# Altium project Z693_H93_KD01_V1.3.PrjPCB
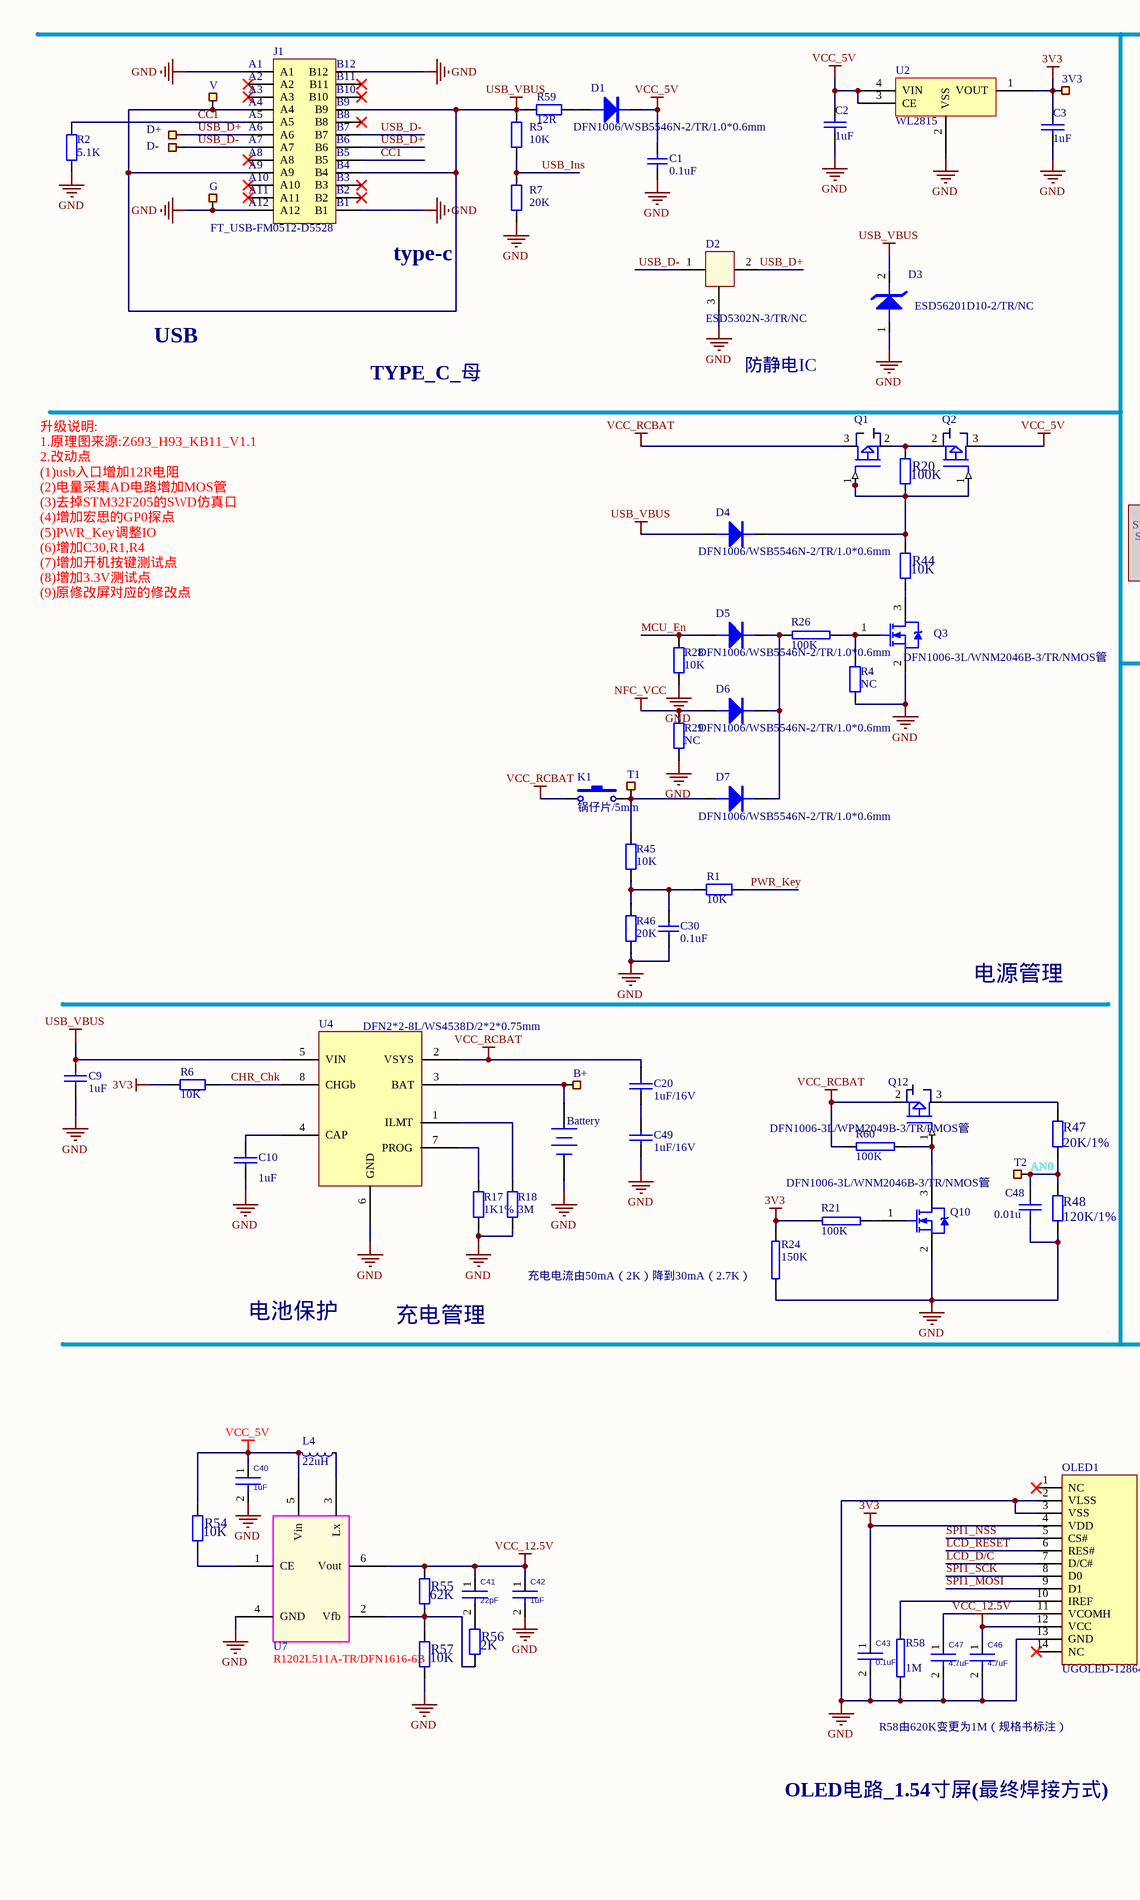
[diagram p0: Z693_H93_KD01_V1.3.SchDoc, left]
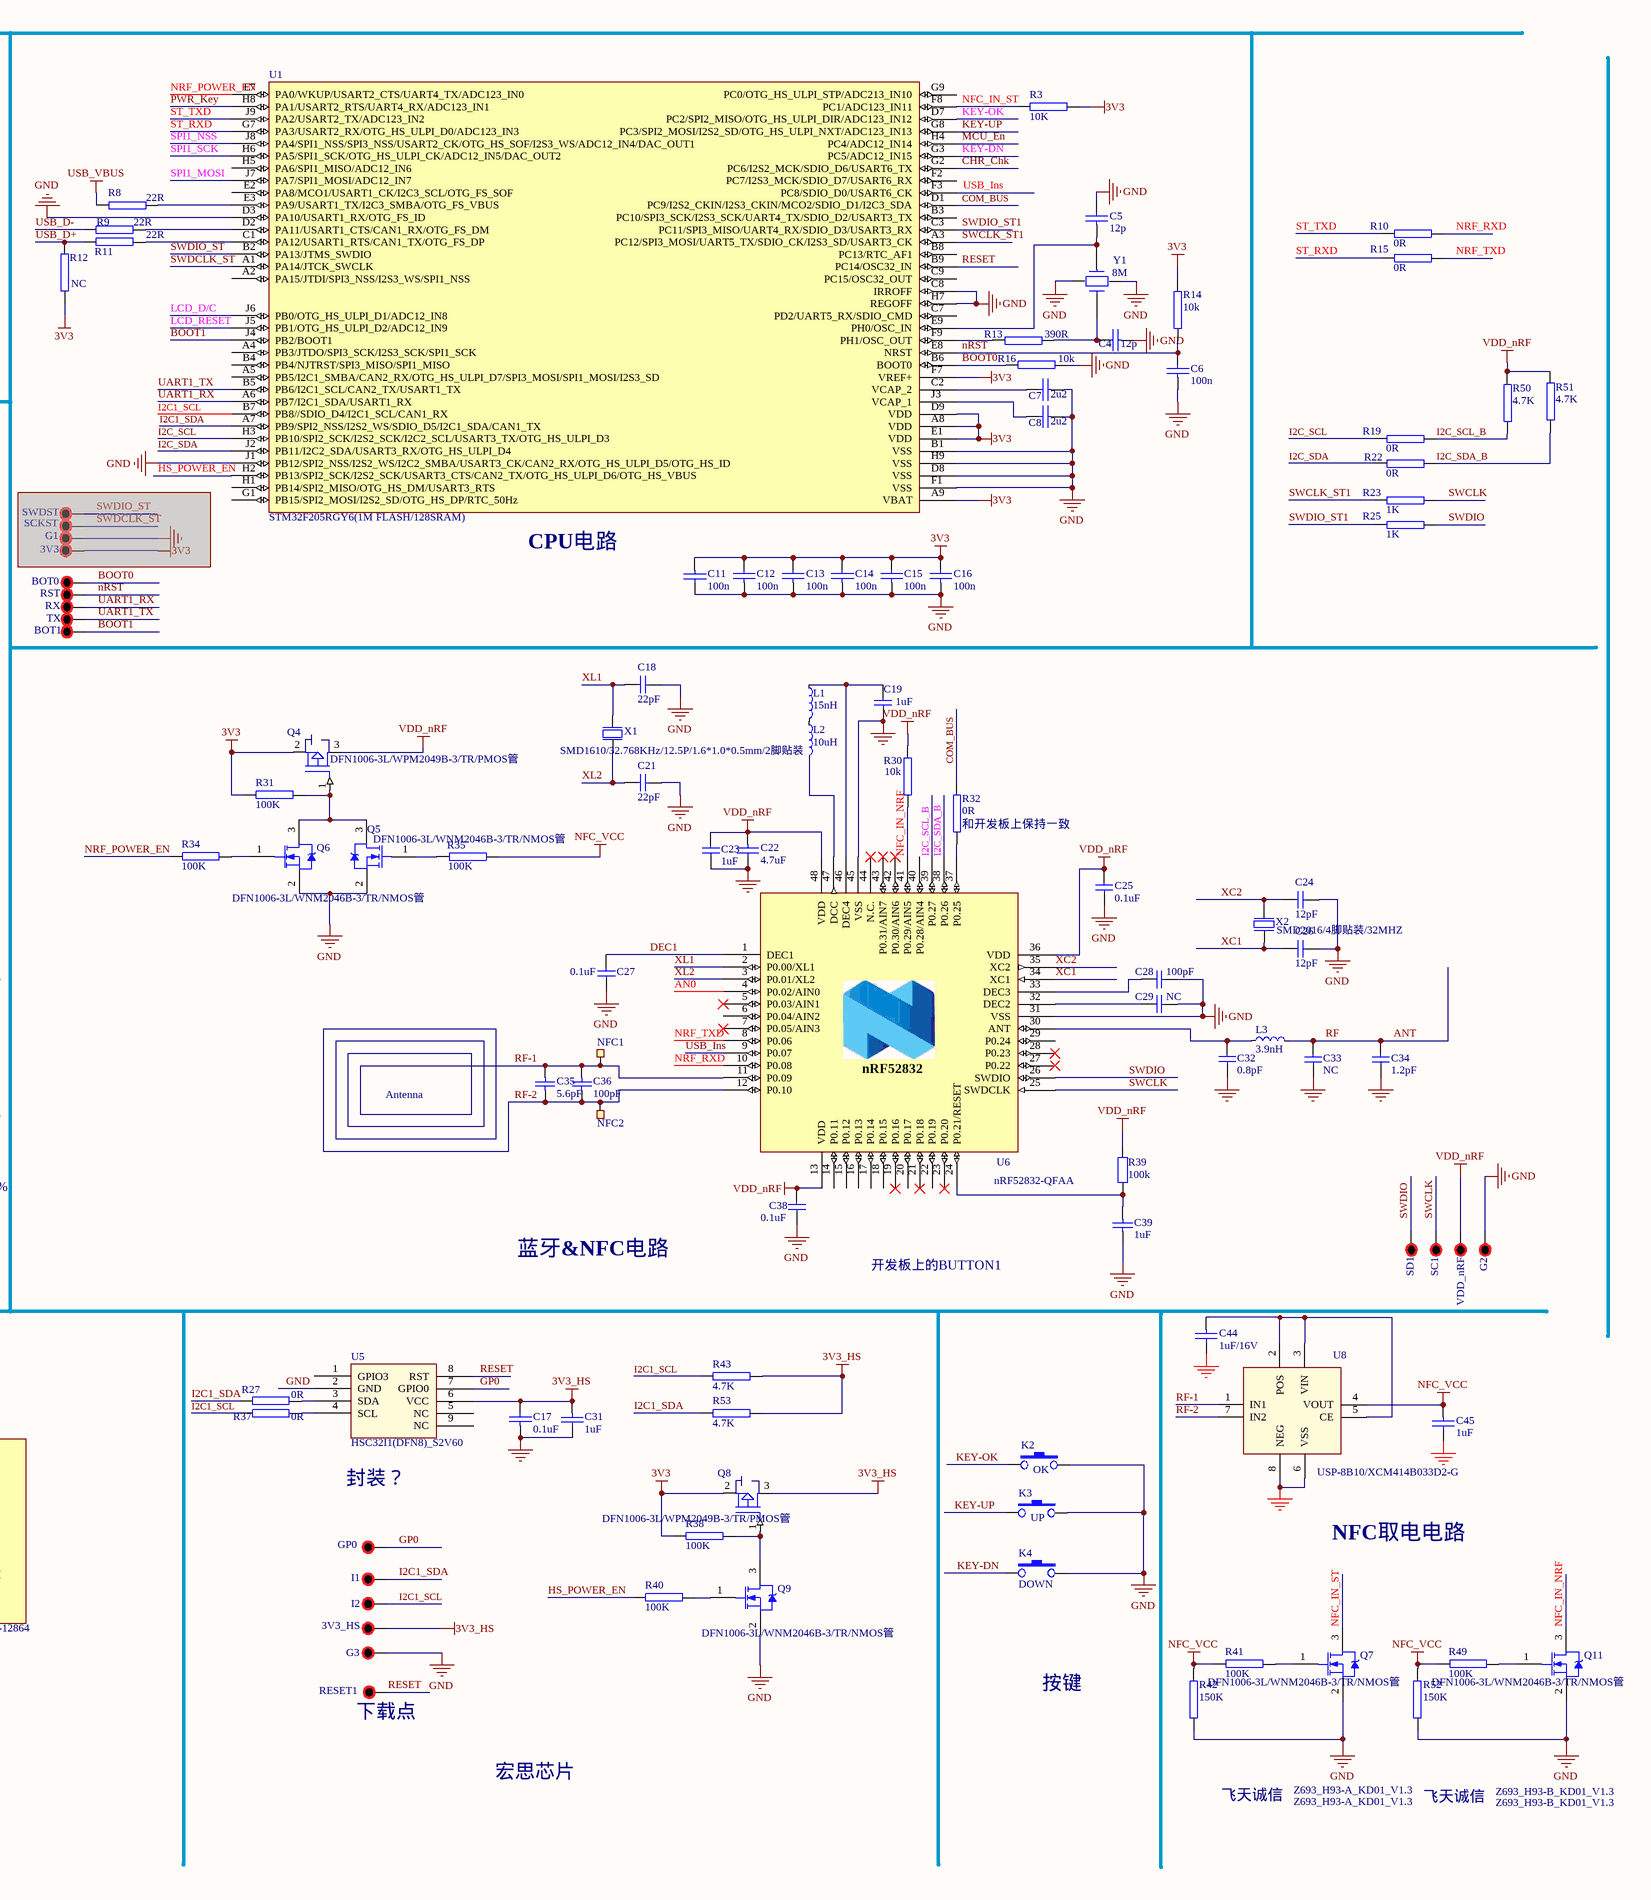
[diagram p1: Z693_H93_KD01_V1.3.SchDoc, right]
1 sheet, 177 parts. Net scope: global (net labels, ports and power ports of the same name join across sheets).
Board files: Z693_H93_KD01_V1.3.PcbDoc, Z693_H93-A_KD01_V1.3_X6.PcbDoc, Z693_H93-B_KD01_V1.3.PcbDoc

## Sheet Z693_H93_KD01_V1.3.SchDoc
size A2

### Parts
(Parts that share a designator on the sheet are numbered #1, #2 ... from top to bottom, then left to right.)
3V3#1  (no value)  [FT_TEST_1]
3V3#2  (no value)  [FT_TEST_1]  (masked out: inside a compile mask, not in the netlist)
3V3_HS  (no value)  [FT_TEST_1]
B+  (no value)  [FT_TEST_1]
Battery  100mAh  [FT_CELL]  (value not drawn)
BOT0  (no value)  [FT_TEST_1]
BOT1  (no value)  [FT_TEST_1]
C1  0.1uF  [FT_0201_电容]
C2  1uF  [FT_0201_电容]
C3  1uF  [FT_0201_电容]
C4  12p  [FT_0201_电容]
C5  12p  [FT_0201_电容]
C6  100n  [FT_0201_电容]
C7  2u2  [FT_0201_电容]
C8  2u2  [FT_0201_电容]
C9  1uF  [FT_0201_电容]
C10  1uF  [FT_0201_电容]
C11  100n  [FT_0201_电容]
C12  100n  [FT_0201_电容]
C13  100n  [FT_0201_电容]
C14  100n  [FT_0201_电容]
C15  100n  [FT_0201_电容]
C16  100n  [FT_0201_电容]
C17  0.1uF  [FT_0201_电容]
C18  22pF  [FT_0201_电容]
C19  1uF  [FT_0201_电容]
C20  1uF/16V  [FT_0201_电容]
C21  22pF  [FT_0201_电容]
C22  4.7uF  [FT_0402_C_3D]
C23  1uF  [FT_0201_电容]
C24  12pF  [FT_0201_电容]
C25  0.1uF  [FT_0201_电容]
C26  12pF  [FT_0201_电容]
C27  0.1uF  [FT_0201_电容]
C28  100pF  [FT_0201_电容]
C29  NC  [FT_0201_电容]
C30  0.1uF  [FT_0201_电容]
C31  1uF  [FT_0201_电容]
C32  0.8pF  [FT_0201_电容]
C33  NC  [FT_0201_电容]
C34  1.2pF  [FT_0201_电容]
C35  5.6pF  [FT_0201_电容]
C36  100pF  [FT_0201_电容]
C38  0.1uF  [FT_0201_电容]
C39  1uF  [FT_0201_电容]
C40  1uF  [FT_0201_电容]
C41  22pF  [FT_0201_电容]
C42  1uF  [FT_0201_电容]
C43  0.1uF  [FT_0201_电容]
C44  1uF/16V  [FT_0201_电容]
C45  1uF  [FT_0201_电容]
C46  4.7uF  [FT_0402_C_3D]
C47  4.7uF  [FT_0402_C_3D]
C48  0.01u  [FT_0201_电容]
C49  1uF/16V  [FT_0201_电容]
D1  DFN1006/WSB5546N-2/TR/1.0*0.6mm  [FT_DFN1006_WSB5546N-2]
D2  ESD5302N-3/TR/NC  [FT_DFN1006-3L/WPM2049B-3/TR_1.06*0.65*0.4]
D3  ESD56201D10-2/TR/NC  [FT_DFN1610_1.65*1.05*0.55]
D4  DFN1006/WSB5546N-2/TR/1.0*0.6mm  [FT_DFN1006_WSB5546N-2]
D5  DFN1006/WSB5546N-2/TR/1.0*0.6mm  [FT_DFN1006_WSB5546N-2]
D6  DFN1006/WSB5546N-2/TR/1.0*0.6mm  [FT_DFN1006_WSB5546N-2]
D7  DFN1006/WSB5546N-2/TR/1.0*0.6mm  [FT_DFN1006_WSB5546N-2]
D+  (no value)  [FT_TEST_1]
D-  (no value)  [FT_TEST_1]
G  (no value)  [FT_TEST_1]
G1  (no value)  [FT_TEST_1]  (masked out: inside a compile mask, not in the netlist)
G2  (no value)  [FT_TEST_1]
G3  (no value)  [FT_TEST_1]
GP0  (no value)  [FT_TEST_1]
I1  (no value)  [FT_TEST_1]
I2  (no value)  [FT_TEST_1]
J1  FT_USB-FM0512-D5528  [U22401-1]
K1  锅仔片/5mm  [FT_BUTTON_5mm]
K2  OK  [FT_BUTTON_5mm]
K3  UP  [FT_BUTTON_5mm]
K4  DOWN  [FT_BUTTON_5mm]
L1  15nH  [FT_0201_电容]
L2  10uH  [FT_0603 - C_3D]
L3  3.9nH  [FT_0201_电容]
L4  22uH  [FT_0805C]
NFC1  (no value)  [FT_TEST_1]
NFC2  (no value)  [FT_TEST_1]
OLED1  UGOLED-12864  [OLED14]
Q1  DFN1006-3L/WPM2049B-3/TR/PMOS管  [FT_DFN1006-3L/WPM2049B-3/TR_1.06*0.65*0.4]  (value not drawn)
Q2  DFN1006-3L/WPM2049B-3/TR/PMOS管  [FT_DFN1006-3L/WPM2049B-3/TR_1.06*0.65*0.4]  (value not drawn)
Q3  DFN1006-3L/WNM2046B-3/TR/NMOS管  [FT_DFN1006-3L/WPM2049B-3/TR_1.06*0.65*0.4]
Q4  DFN1006-3L/WPM2049B-3/TR/PMOS管  [FT_DFN1006-3L/WPM2049B-3/TR_1.06*0.65*0.4]
Q5  DFN1006-3L/WNM2046B-3/TR/NMOS管  [FT_DFN1006-3L/WPM2049B-3/TR_1.06*0.65*0.4]
Q6  DFN1006-3L/WNM2046B-3/TR/NMOS管  [FT_DFN1006-3L/WPM2049B-3/TR_1.06*0.65*0.4]
Q7  DFN1006-3L/WNM2046B-3/TR/NMOS管  [FT_DFN1006-3L/WPM2049B-3/TR_1.06*0.65*0.4]
Q8  DFN1006-3L/WPM2049B-3/TR/PMOS管  [FT_DFN1006-3L/WPM2049B-3/TR_1.06*0.65*0.4]
Q9  DFN1006-3L/WNM2046B-3/TR/NMOS管  [FT_DFN1006-3L/WPM2049B-3/TR_1.06*0.65*0.4]
Q10  DFN1006-3L/WNM2046B-3/TR/NMOS管  [FT_DFN1006-3L/WPM2049B-3/TR_1.06*0.65*0.4]
Q11  DFN1006-3L/WNM2046B-3/TR/NMOS管  [FT_DFN1006-3L/WPM2049B-3/TR_1.06*0.65*0.4]
Q12  DFN1006-3L/WPM2049B-3/TR/PMOS管  [FT_DFN1006-3L/WPM2049B-3/TR_1.06*0.65*0.4]
R1  10K  [FT_0201_电阻]
R2  5.1K  [FT_0201_电阻]
R3  10K  [FT_0201_电阻]
R4  NC  [FT_0201_电阻]
R5  10K  [FT_0201_电阻]
R6  10K  [FT_0201_电阻]
R7  20K  [FT_0201_电阻]
R8  22R  [FT_0201_电阻]
R9  22R  [FT_0201_电阻]
R10  0R  [FT_0201_电阻]
R11  22R  [FT_0201_电阻]
R12  NC  [FT_0201_电阻]
R13  390R  [FT_0201_电阻]
R14  10k  [FT_0201_电阻]
R15  0R  [FT_0201_电阻]
R16  10k  [FT_0201_电阻]
R17  1K1%  [FT_0201_电阻]
R18  3M  [FT_0201_电阻]
R19  0R  [FT_0201_电阻]
R20  100K  [FT_0201_电阻]
R21  100K  [FT_0201_电阻]
R22  0R  [FT_0201_电阻]
R23  1K  [FT_0201_电阻]
R24  150K  [FT_0201_电阻]
R25  1K  [FT_0201_电阻]
R26  100K  [FT_0201_电阻]
R27  0R  [FT_0201_电阻]
R28  10K  [FT_0201_电阻]
R29  NC  [FT_0201_电阻]
R30  10k  [FT_0201_电阻]
R31  100K  [FT_0201_电阻]
R32  0R  [FT_0201_电阻]
R34  100K  [FT_0201_电阻]
R35  100K  [FT_0201_电阻]
R37  0R  [FT_0201_电阻]
R38  100K  [FT_0201_电阻]
R39  100k  [FT_0201_电阻]
R40  100K  [FT_0201_电阻]
R41  100K  [FT_0201_电阻]
R42  150K  [FT_0201_电阻]
R43  4.7K  [FT_0201_电阻]
R44  10K  [FT_0201_电阻]
R45  10K  [FT_0201_电阻]
R46  20K  [FT_0201_电阻]
R47  20K/1%  [FT_0201_电阻]
R48  120K/1%  [FT_0201_电阻]
R49  100K  [FT_0201_电阻]
R50  4.7K  [FT_0201_电阻]
R51  4.7K  [FT_0201_电阻]
R52  150K  [FT_0201_电阻]
R53  4.7K  [FT_0201_电阻]
R54  10K  [FT_0201_电阻]
R55  62K  [FT_0201_电阻]
R56  2K  [FT_0201_电阻]
R57  10K  [FT_0201_电阻]
R58  1M  [FT_0201_电阻]
R59  12R  [FT_0805]
R60  100K  [FT_0201_电阻]
RESET1  (no value)  [FT_TEST_1]
RST  (no value)  [FT_TEST_1]
RX  (no value)  [FT_TEST_1]
SC1  (no value)  [FT_TEST_1]
SCKST  (no value)  [FT_TEST_1]  (masked out: inside a compile mask, not in the netlist)
SD1  (no value)  [FT_TEST_1]
SWDST  (no value)  [FT_TEST_1]  (masked out: inside a compile mask, not in the netlist)
T1  (no value)  [FT_TEST_1]
T2  (no value)  [FT_TEST_1]
TX  (no value)  [FT_TEST_1]
U1  STM32F205RGY6(1M FLASH/128SRAM)  [WLCSP64]
U2  WL2815  [FT_DFN1X1-4L]
U4  DFN2*2-8L/WS4538D/2*2*0.75mm  [FT_DFN2X2X0.75-8L]
U5  HSC32I1(DFN8)_S2V60  [DFN8_NEW_MORE]
U6  nRF52832-QFAA  [QFN48N]
U7  R1202L511A-TR/DFN1616-6B  [DFN1616-6B]
U8  USP-8B10/XCM414B033D2-G  [XCM414-USP-8B10]
V  (no value)  [FT_TEST_1]
VDD_nRF  (no value)  [FT_TEST_1]
X1  SMD1610/32.768KHz/12.5P/1.6*1.0*0.5mm/2脚贴装  [FT_OSC_32.768M_SMD_2]
X2  SMD2016/4脚贴装/32MHZ  [FT_SMD2520_4]
Y1  8M  [FT_OSC_4-3225]
Z693_H93-A_KD01_V1.3  Z693_H93-A_KD01_V1.3  [FT_LOGO_300_Y]
Z693_H93-B_KD01_V1.3  Z693_H93-B_KD01_V1.3  [FT_LOGO_300_Y]

### Nets
3V3: 3V3#1.1 C3.1 C11.1 C12.2 C13.2 C14.2 C15.2 C16.2 C43.1 OLED1.4(VDD) Q4.2(S) Q8.2(S) R3.1 R6.1 R12.2 R14.2 R21.2 R24.2 R31.2 R38.2 U1.A8(VDD) U1.A9(VBAT) U1.D9(VDD) U1.E1(VDD) U1.F7(VREF+) U2.1(VOUT)
3V3_HS: 3V3_HS.1 C17.2 C31.1 Q8.3(D) R43.1 R53.1 U5.6(VCC)
GND: Battery.2(-) C1.2 C2.2 C3.2 C4.1 C5.2 C6.1 C7.1 C8.1 C9.1 C10.1 C11.2 C12.1 C13.1 C14.1 C15.1 C16.1 C17.1 C18.2 C19.1 C21.2 C22.2 C23.2 C24.2 C25.2 C26.2 C27.2 C28.2 C29.2 C30.2 C31.2 C32.1 C33.2 C34.2 C38.2 C39.2 C40.2 C42.2 C43.2 C44.2 C45.2 C46.2 C47.2 C48.1 C49.1 D2.3 D3.1 G.1 G2.1 G3.1 J1.A1 J1.A12 J1.B1 J1.B12 K2.2 K3.2 K4.2 OLED1.2(VLSS) OLED1.3(VSS) OLED1.13(GND) Q3.2(S) Q5.2(S) Q6.2(S) Q7.2(S) Q9.2(S) Q10.2(S) Q11.2(S) R2.2 R4.2 R7.1 R16.1 R17.1 R18.1 R24.1 R28.2 R29.1 R42.1 R46.1 R48.1 R52.1 R57.1 R58.2 U1.B1(VSS) U1.C8(IRROFF) U1.D3(PA10/USART1_RX/OTG_FS_ID) U1.D8(VSS) U1.F1(VSS) U1.H7(REGOFF) U1.H9(VSS) U1.J1(PB12/SPI2_NSS/I2S2_WS/I2C2_SMBA/USART3_CK/CAN2_RX/OTG_HS_ULPI_D5/OTG_HS_ID) U2.2(VSS) U4.6(GND) U5.2(GND) U6.31(VSS) U6.45(VSS) U6.49(GND) U7.4(GND) U8.6(VSS) U8.8(NEG) X2.2(GND) X2.4(GND) Y1.2 Y1.4
NFC_VCC: C45.1 D6.1 R29.2 R35.2 R41.2 R42.2 R49.2 R52.2 U8.4(VOUT)
USB_VBUS: C9.2 D3.2 D4.1 J1.A4 J1.A9 J1.B4 J1.B9 R5.2 R8.1 R59.2 U4.5(VIN) V.1
VCC_5V: C1.1 C2.1 C40.1 D1.2 L4.2 Q2.3(D) R54.2 U2.3(CE) U2.4(VIN) U7.5(Vin)
VCC_12.5V: C41.1 C42.1 C46.1 OLED1.12(VCC) R55.2 U7.6(Vout)
VCC_RCBAT: C20.2 K1.2 Q1.3(D) Q12.2(S) R60.2 U4.2(VSYS)
VDD_nRF: C22.1 C23.1 C25.1 C38.1 Q4.3(D) R30.1 R39.2 R50.1 R51.1 U6.13(VDD) U6.36(VDD) U6.48(VDD) VDD_nRF.1
AN0: C48.2 R47.1 R48.2 T2.1 U6.4(P0.02/AIN0)
ANT: C33.1 C34.1 L3.2  [also labelled RF]
BOOT0: BOT0.1 R16.2 U1.B6(BOOT0)
BOOT1: BOT1.1 U1.J4(PB2/BOOT1)
CC1: J1.A5 J1.B5 R2.1
CHR_Chk: R6.2 U1.G2(PC6/I2S2_MCK/SDIO_D6/USART6_TX) U4.8(CHGb)
COM_BUS: R32.1 U1.D1(PC9/I2S2_CKIN/I2S3_CKIN/MCO2/SDIO_D1/I2C3_SDA)
DEC1: C27.1 U6.1(DEC1)
GP0: GP0.1 U5.7(GPIO0)
HS_POWER_EN: R40.2 U1.H2(PB13/SPI2_SCK/I2S2_SCK/USART3_CTS/CAN2_TX/OTG_HS_ULPI_D6/OTG_HS_VBUS)
I2C1_SCL: I2.1 R37.2 R43.2 U1.B7(PB8//SDIO_D4/I2C1_SCL/CAN1_RX)
I2C1_SDA: I1.1 R27.2 R53.2 U1.A7(PB9/SPI2_NSS/I2S2_WS/SDIO_D5/I2C1_SDA/CAN1_TX)
I2C_SCL: R19.1 U1.H3(PB10/SPI2_SCK/I2S2_SCK/I2C2_SCL/USART3_TX/OTG_HS_ULPI_D3)
I2C_SCL_B: R19.2 R50.2 U6.39(P0.27)
I2C_SDA: R22.1 U1.J2(PB11/I2C2_SDA/USART3_RX/OTG_HS_ULPI_D4)
I2C_SDA_B: R22.2 R51.2 U6.38(P0.26)
KEY-DN: K4.1 U1.G3(PC5/ADC12_IN15)
KEY-OK: K2.1 U1.D7(PC2/SPI2_MISO/OTG_HS_ULPI_DIR/ADC123_IN12)
KEY-UP: K3.1 U1.G8(PC3/SPI2_MOSI/I2S2_SD/OTG_HS_ULPI_NXT/ADC123_IN13)
LCD_D/C: OLED1.7(D/C#) U1.J6(PB0/OTG_HS_ULPI_D1/ADC12_IN8)
LCD_RESET: OLED1.6(RES#) U1.J5(PB1/OTG_HS_ULPI_D2/ADC12_IN9)
MCU_En: D5.1 R28.1 U1.H4(PC4/ADC12_IN14)
NFC_IN_NRF: Q11.3(D) R30.2 U6.41(P0.29/AIN5)
NFC_IN_ST: Q7.3(D) R3.2 U1.F8(PC1/ADC123_IN11)
NRF_POWER_EN: R34.2 U1.E7(PA0/WKUP/USART2_CTS/UART4_TX/ADC123_IN0)
NRF_RXD: R10.2 U6.10(P0.08)
NRF_TXD: R15.2 U6.8(P0.06)
nRST: C6.2 R14.1 RST.1 U1.E8(NRST)
PWR_Key: R1.1 U1.H8(PA1/USART2_RTS/UART4_RX/ADC123_IN1)
RESET: RESET1.1 U1.B9(PC14/OSC32_IN) U5.8(RST)
RF-1: C35.1 C35.2 C36.1 C36.2 NFC1.1 NFC2.1 U6.11(P0.09) U6.12(P0.10) U8.1(IN1) U8.7(IN2)  [also labelled RF-2]
SPI1_MOSI: OLED1.9(D1) U1.J7(PA7/SPI1_MOSI/ADC12_IN7)
SPI1_NSS: OLED1.5(CS#) U1.J8(PA4/SPI1_NSS/SPI3_NSS/USART2_CK/OTG_HS_SOF/I2S3_WS/ADC12_IN4/DAC_OUT1)
SPI1_SCK: OLED1.8(D0) U1.H6(PA5/SPI1_SCK/OTG_HS_ULPI_CK/ADC12_IN5/DAC_OUT2)
ST_RXD: R15.1 U1.G7(PA3/USART2_RX/OTG_HS_ULPI_D0/ADC123_IN3)
ST_TXD: R10.1 U1.J9(PA2/USART2_TX/ADC123_IN2)
SWCLK: R23.2 SC1.1 U6.25(SWDCLK)
SWCLK_ST1: R23.1 U1.A3(PC12/SPI3_MOSI/UART5_TX/SDIO_CK/I2S3_SD/USART3_CK)
SWDCLK_ST: U1.A1(PA14/JTCK_SWCLK)
SWDIO: R25.2 SD1.1 U6.26(SWDIO)
SWDIO_ST: U1.B2(PA13/JTMS_SWDIO)
SWDIO_ST1: R25.1 U1.C3(PC11/SPI3_MISO/UART4_RX/SDIO_D3/USART3_RX)
UART1_RX: RX.1 U1.A6(PB7/I2C1_SDA/USART1_RX)
UART1_TX: TX.1 U1.B5(PB6/I2C1_SCL/CAN2_TX/USART1_TX)
USB_D+: D2.2 D+.1 J1.A6 J1.B6 R11.2 R12.1
USB_D-: D2.1 D-.1 J1.A7 J1.B7 R9.2
USB_Ins: R5.1 R7.2 U1.F3(PC8/SDIO_D0/USART6_CK) U6.9(P0.07)
XC1: C26.1 U6.34(XC1) X2.3(out)
XC2: C24.1 U6.35(XC2) X2.1(inp)
XL1: C18.1 U6.2(P0.00/XL1) X1.1(inp)
XL2: C21.1 U6.3(P0.01/XL2) X1.2(out)
NetB+_1: B+.1 Battery.1(+) U4.3(BAT)
NetC4_2: C4.2 R13.2 Y1.3
NetC5_1: C5.1 U1.E9(PH0/OSC_IN) Y1.1
NetC7_2: C7.2 U1.C2(VCAP_2)
NetC8_2: C8.2 U1.J3(VCAP_1)
NetC10_2: C10.2 U4.4(CAP)
NetC19_2: C19.2 L1.1 U6.46(DEC4)
NetC20_1: C20.1 C49.2
NetC28_1: C28.1 U6.33(DEC3)
NetC29_1: C29.1 U6.32(DEC2)
NetC30_1: C30.1 R1.2 R45.1 R46.2
NetC32_2: C32.2 L3.1 U6.30(ANT)
NetC39_1: C39.1 R39.1 U6.24(P0.21/RESET)
NetC41_2: C41.2 R56.2
NetC44_1: C44.1 U8.2(POS) U8.3(VIN) U8.5(CE)
NetC47_1: C47.1 OLED1.11(VCOMH)
NetD1_1: D1.1 R59.1
NetD4_2: D4.2 Q1.1(G) Q2.1(G) R20.1 R44.2
NetD5_2: D5.2 D6.2 D7.2 R26.2
NetD7_1: D7.1 K1.1 R45.2 T1.1
NetL1_2: L1.2 L2.1
NetL2_2: L2.2 U6.47(DCC)
NetL4_1: L4.1 U7.3(Lx)
NetOLED1_10: OLED1.10(IREF) R58.1
NetQ1_2: Q1.2(S) Q2.2(S) R20.2
NetQ3_1: Q3.1(G) R4.1 R26.1
NetQ3_3: Q3.3(D) R44.1
NetQ4_1: Q4.1(G) Q5.3(D) Q6.3(D) R31.1
NetQ5_1: Q5.1(G) R35.1
NetQ6_1: Q6.1(G) R34.1
NetQ7_1: Q7.1(G) R41.1
NetQ8_1: Q8.1(G) Q9.3(D) R38.1
NetQ9_1: Q9.1(G) R40.1
NetQ10_1: Q10.1(G) R21.1
NetQ10_3: Q10.3(D) Q12.1(G) R60.1
NetQ11_1: Q11.1(G) R49.1
NetQ12_3: Q12.3(D) R47.2
NetR8_2: R8.2 U1.E3(PA9/USART1_TX/I2C3_SMBA/OTG_FS_VBUS)
NetR9_1: R9.1 U1.D2(PA11/USART1_CTS/CAN1_RX/OTG_FS_DM)
NetR11_1: R11.1 U1.C1(PA12/USART1_RTS/CAN1_TX/OTG_FS_DP)
NetR13_1: R13.1 U1.F9(PH1/OSC_OUT)
NetR17_2: R17.2 U4.7(PROG)
NetR18_2: R18.2 U4.1(ILMT)
NetR27_1: R27.1 U5.3(SDA)
NetR32_2: R32.2 U6.37(P0.25)
NetR37_1: R37.1 U5.4(SCL)
NetR54_1: R54.1 U7.1(CE)
NetR55_1: R55.1 R56.1 R57.2 U7.2(Vfb)

Not connected (* = marked no-connect by the designer): J1 A2* A3* A8* A10* A11* B2* B3* B8* B10* B11*; OLED1 1(NC)* 14(NC)*; U1 A2(PA15/JTDI/SPI3_NSS/I2S3_WS/SPI1_NSS) A4(PB3/JTDO/SPI3_SCK/I2S3_SCK/SPI1_SCK) A5(PB5/I2C1_SMBA/CAN2_RX/OTG_HS_ULPI_D7/SPI3_MOSI/SPI1_MOSI/I2S3_SD) B3(PC10/SPI3_SCK/I2S3_SCK/UART4_TX/SDIO_D2/USART3_TX) B4(PB4/NJTRST/SPI3_MISO/SPI1_MISO) B8(PC13/RTC_AF1) C7(PD2/UART5_RX/SDIO_CMD) C9(PC15/OSC32_OUT) E2(PA8/MCO1/USART1_CK/I2C3_SCL/OTG_FS_SOF) F2(PC7/I2S3_MCK/SDIO_D7/USART6_RX) G1(PB15/SPI2_MOSI/I2S2_SD/OTG_HS_DP/RTC_50Hz) G9(PC0/OTG_HS_ULPI_STP/ADC213_IN10) H1(PB14/SPI2_MISO/OTG_HS_DM/USART3_RTS) H5(PA6/SPI1_MISO/ADC12_IN6); U5 1(GPIO3) 5(NC) 9(NC); U6 5(P0.03/AIN1)* 6(P0.04/AIN2) 7(P0.05/AIN3)* 14(P0.11) 15(P0.12) 16(P0.13) 17(P0.14) 18(P0.15) 19(P0.16)* 20(P0.17) 21(P0.18)* 22(P0.19) 23(P0.20)* 27(P0.22)* 28(P0.23)* 29(P0.24) 40(P0.28/AIN4) 42(P0.30/AIN6)* 43(P0.31/AIN7)* 44(N.C.)*

### Notes on the sheet
- (near J1) A1
- (near J1) A2
- (near J1) A3
- (near J1) B10
- (near J1) B11
- (near J1) B12
- (near J1) A4
- (near J1) A5
- (near J1) A6
- (near J1) A7
- (near J1) A8
- (near J1) B5
- (near J1) B6
- (near J1) B7
- (near J1) B8
- (near J1) B9
- (near J1) A9
- (near J1) A10
- (near J1) A11
- (near J1) A12
- (near J1) B1
- (near J1) B2
- (near J1) B3
- (near J1) B4
- type-c
- USB
- TYPE_C_母
- 防静电IC
- (near U1) CPU电路
- (near R32) 和开发板上保持一致
- 升级说明:
  1.原理图来源:Z693_H93_KB11_V1.1
  2.改动点
  (1)usb入口增加12R电阻
  (2)电量采集AD电路增加MOS管
  (3)去掉STM32F205的SWD仿真口
  (4)增加宏思的GP0探点
  (5)PWR_Key调整IO
  (6)增加C30,R1,R4
  (7)增加开机按键测试点
  (8)增加3.3V测试点
  (9)原修改屏对应的修改点
- 电源管理
- Antenna
- 充电电流由50mA（2K）降到30mA（2.7K）
- 蓝牙&NFC电路
- 电池保护
- 充电管理
- 开发板上的BUTTON1
- 封装？
- NFC取电电路
- R58由620K变更为1M（规格书标注）
- 按键
- OLED电路_1.54寸屏(最终焊接方式)
- (near RESET1) 下载点
- 宏思芯片
- (in symbol LOGO) 飞天诚信
- (in symbol nRF52832-QFAA) nRF52832

### Library data of the parts
3V3#1 B+ D+ D- G NFC1 NFC2 T1 T2 V = JC-1: JC-2; VAL: *; DEV: *; REF: *; TOL: *; DESIG: *; BOI: *; FAB: *; PUI: *; REV: *
3V3#2 3V3_HS BOT0 BOT1 G1-G3 GP0 I1 I2 RESET1 RST RX SC1 SCKST SD1 SWDST TX VDD_nRF = TEST
Battery = Battery: Part Number: CR2032-1F2
C1 C30 C39 = Capacitor: CAP CER .1UF 16V 10% X7R 0603; Part Number: GRM188R71C104KA01D; Manufacturer: Murata Electronics North America; Supplier 1: Digi-Key; Supplier Part Number 1: 490-1532-2-ND; Manufacturer Part Number: GRM188R71C104KA01D
C2 C3 C9 C10 C17 C20 C22 C31 C48 C49 = CAP: Capacitor
C4-C8 C11-C16 = cap: Capacitor
C18 C21 = CAP: Capacitor, NP0, ?%; Part Number: C0402-12p; Value: 12pF; Note: 50V; Artikkelnr Noca: 20029159; Artikkelnr Simpro: N.A.; Manufacturer: *; Manufacturer Part Number: *; Datasheet: *; LatestRevisionDate: 2011-05-11; Pin Count: 2; Publisher: Nordic Semiconductor; Published: 2009-05-08; Supplier: *; Supplier part number: *; 2nd source Supplier: *; 2nd source part number: *; Footprint Doc: 0402
C19 = C0603-1?: Capacitor, X7R, ?0%; Value: 1.0µF; Note: 16V; Artikkelnr Noca: 20039335; Artikkelnr Simpro: N.A.; Part Number: C0603-1?; Manufacturer: *; Manufacturer Part Number: *; Datasheet: *; LatestRevisionDate: 2013-06-05; Pin Count: 2; Publisher: Nordic Semiconductor; Published: 2009-05-08; Supplier: *; Supplier part number: *; 2nd source Supplier: *; 2nd source part number: *; Footprint Doc: 0603
C23 C27 = CAP: Capacitor, X5R, ?0%; Part Number: C0603-4?; Value: 4.7μF; Note: 6.3V; Artikkelnr Noca: 20069060; Artikkelnr Simpro: N.A.; Manufacturer: *; Manufacturer Part Number: *; Datasheet: *; LatestRevisionDate: 2009-11-23; Pin Count: 2; Publisher: Nordic Semiconductor; Published: 2009-05-08; Supplier: *; Supplier part number: *; 2nd source Supplier: *; 2nd source part number: *; Footprint Doc: 0603
C24 C26 = CAP: Capacitor, NP0, ?%; Part Number: C0402-12p; Note: 50V; Artikkelnr Noca: 20029159; Artikkelnr Simpro: N.A.; Manufacturer: *; Manufacturer Part Number: *; Datasheet: *; LatestRevisionDate: 2011-05-11; Pin Count: 2; Publisher: Nordic Semiconductor; Published: 2009-05-08; Value: 12pF; Supplier: *; Supplier part number: *; 2nd source Supplier: *; 2nd source part number: *; Footprint Doc: 0402
C25 = CAP: Capacitor, X7R, ?0%; Part Number: C0402-1n0; Value: 1.0nF; Note: 50V; Artikkelnr Noca: 20039223; Artikkelnr Simpro: N.A.; Manufacturer: *; Manufacturer Part Number: *; Datasheet: *; LatestRevisionDate: 2009-11-23; Pin Count: 2; Publisher: Nordic Semiconductor; Published: 2009-05-08; Supplier: *; Supplier part number: *; 2nd source Supplier: *; 2nd source part number: *; Footprint Doc: 0402
C28 = CAP: Capacitor, X7R, ?0%; Part Number: C0402-47n; Value: 47nF; Note: Chip Cap 10%; Artikkelnr Noca: 20039389; Artikkelnr Simpro: N.A.; Manufacturer: *; Manufacturer Part Number: *; Datasheet: *; LatestRevisionDate: 2009-05-08; Pin Count: 2; Publisher: Nordic Semiconductor; Published: 2009-05-08; Supplier: *; Supplier part number: *; 2nd source Supplier: *; 2nd source part number: *; Footprint Doc: 0402
C29 = CAP: Capacitor, X7R, ?0%; Part Number: C0402-2n2; Value: 2.2nF; Note: 50V; Artikkelnr Noca: 20039221; Artikkelnr Simpro: N.A.; Manufacturer: *; Manufacturer Part Number: *; Datasheet: *; LatestRevisionDate: 2009-11-23; Pin Count: 2; Publisher: Nordic Semiconductor; Published: 2009-05-08; Supplier: *; Supplier part number: *; 2nd source Supplier: *; 2nd source part number: *; Footprint Doc: 0402
C32 = C0402-0.8p: Capacitor, NP0, ?%; Note: 50V; Artikkelnr Noca: 20029147; Artikkelnr Simpro: N.A.; Part Number: C0402-0.8p; Manufacturer: *; Manufacturer Part Number: *; Datasheet: *; LatestRevisionDate: 2012-11-21; Pin Count: 2; Publisher: Nordic Semiconductor; Published: 2009-05-08; Value: 0.8pF; Supplier: *; Supplier part number: *; 2nd source Supplier: *; 2nd source part number: *; Footprint Doc: 0402
C33 = C0402-N.C.: Not mounted; Value: N.C.; Note: Chip Cap; Artikkelnr Noca: N.A.; Part Number: C0402-N.C.; Manufacturer: *; Manufacturer Part Number: *; Datasheet: *; LatestRevisionDate: 2009-05-08; Pin Count: 2; Publisher: Nordic Semiconductor; Published: 2009-05-08; Supplier: *; Supplier part number: *; 2nd source Supplier: *; 2nd source part number: *; Footprint Doc: 0402; Artikkelnr Simpro: N.A.
C34 = C0402-1.2p: Capacitor, NP0, ?.1pF; Note: 50V; Artikkelnr Noca: 20029157; Artikkelnr Simpro: N.A.; Part Number: C0402-1.2p; Manufacturer: *; Manufacturer Part Number: *; Datasheet: *; LatestRevisionDate: 2011-05-11; Pin Count: 2; Publisher: Nordic Semiconductor; Published: 2009-05-08; Value: 1.2pF; Supplier: *; Supplier part number: *; 2nd source Supplier: *; 2nd source part number: *; Footprint Doc: 0402
C35 C36 = Cap: Capacitor; Value: 0.1uF; Published: 8-Jun-2000; LatestRevisionDate: 17-Jul-2002; LatestRevisionNote: Re-released for DXP Platform.; PackageReference: RAD-0.3; Publisher: Altium Limited
C38 = CAP: Capacitor, X7R, ?0%; Part Number: C0402-100n; Value: 100nF; Note: 16V; Artikkelnr Noca: 20039200; Artikkelnr Simpro: N.A.; Manufacturer: *; Manufacturer Part Number: *; Datasheet: *; LatestRevisionDate: 2009-11-23; Pin Count: 2; Publisher: Nordic Semiconductor; Published: 2009-05-08; Supplier: *; Supplier part number: *; 2nd source Supplier: *; 2nd source part number: *; Footprint Doc: 0402
C40-C43 C46 C47 = C_Dup1
C44 C45 = CAP_1: Capacitor
D1 D4-D7 = DIODE_1N4148
D2 U8 = Component_1
D3 = DIODE_WY
J1 = A7101
K1 = SW-PB-2P: SWITCH USE IN H6; Part Number: B3F-1052
K2-K4 = BUTTON
L1 = L0402-15n: Inductor, 320mA, ?%; Manufacturer: Taiyo Yuden; Manufacturer Part Number: HK100515NJ-T; 2nd source part number: 658-1328; Note: High frequency chip inductor ?0%; Artikkelnr Noca: 33029323; Artikkelnr Simpro: N.A.; Part Number: L0402-15n; LatestRevisionDate: 2012-09-19; Pin Count: 2; Publisher: Nordic Semiconductor; Published: 2010-07-12; Value: 15nH; Supplier: Digi-Key; Datasheet: http://www.yuden.co.jp/productdata/catalog/en/mlci04_e.pdf; Supplier part number: 587-1521-1-ND; 2nd source Supplier: Farnell; Footprint Doc: 0402
L2 = L0603-10?: Inductor, 80mA, ?0%; Manufacturer: Taiyo Yuden; Manufacturer Part Number: LBMF1608T100K; 2nd source part number: 178-6105; Value: 10µH; Note: LBMF1608T100K 10µH 80mA 0603; Artikkelnr Noca: 33029314; Artikkelnr Simpro: N.A.; Part Number: L0603-10?; Datasheet: http://www.yuden.co.jp/ut/product/pdf/elb2_e.pdf; LatestRevisionDate: 2012-09-19; Pin Count: 2; Publisher: Nordic Semiconductor; Published: 2010-02-24; Supplier: Digi-Key; Supplier part number: 587-1714-1-ND; 2nd source Supplier: Farnell; Footprint Doc: 0603
L3 = L0402-3n9: Inductor, 170mA, ?.1nH; Manufacturer: Murata; Manufacturer Part Number: LQP15MN3N9B02D; Note: High frequency chip inductor ?%; Artikkelnr Noca: 33029151; Artikkelnr Simpro: N.A.; Part Number: L0402-3n9; Datasheet: http://search.murata.co.jp/Ceramy/image/img/PDF/ENG/L0075S0084LQP15M.pdf; LatestRevisionDate: 2012-09-19; Pin Count: 2; Publisher: Nordic Semiconductor; Published: 2009-05-08; Value: 3.9nH; Supplier: Digi-Key; Supplier part number: 490-1131-1-ND; 2nd source Supplier: *; 2nd source part number: *; Footprint Doc: 0402
L4 = L0402-15n: Inductor, 320mA, ?%; Manufacturer: Taiyo Yuden; Manufacturer Part Number: HK100515NJ-T; 2nd source part number: 658-1328; Value: 15nH; Note: High frequency chip inductor ?0%; Artikkelnr Noca: 33029323; Artikkelnr Simpro: N.A.; Part Number: L0402-15n; LatestRevisionDate: 2012-09-19; Pin Count: 2; Publisher: Nordic Semiconductor; Published: 2010-07-12; Supplier: Digi-Key; Datasheet: http://www.yuden.co.jp/productdata/catalog/en/mlci04_e.pdf; Supplier part number: 587-1521-1-ND; 2nd source Supplier: Farnell; Footprint Doc: 0402
OLED1 = CON5: Connector
Q1 Q2 Q4 Q8 Q12 = SI2301
Q3 Q5-Q7 Q9-Q11 = NMOS-2: N-Channel Power MOSFET; Note: Pin 2 is electrically connected to pin 4.; Published: 8-Jun-2000; LatestRevisionDate: 17-Jul-2002; LatestRevisionNote: Re-released for DXP Platform.; DatasheetVersion: PD-9.814; PackageReference: TO-220AB; Publisher: Altium Limited; Code_JEDEC: TO-220-AB; ComponentLink1Description: Manufacturer Link; ComponentLink1URL: http://www.irf.com/
R1 R4-R7 R17 R18 R28 R29 R39 R45 R46 R59 = Resistor: RES 1.0M OHM 1/10W 5% 0603 SMD; Part Number: RC0603JR-071ML; Manufacturer: Yageo; Supplier 1: Digi-Key; Supplier Part Number 1: 311-1.0MGRDKR-ND; Manufacturer Part Number: RC0603JR-071ML
R2 = RC0603JR-071ML: RES 1.0M OHM 1/10W 5% 0402 SMD; Part Number: RC0402JR-071ML; Manufacturer: Yageo; Supplier 1: Digi-Key; Supplier Part Number 1: 311-1.0MGRDKR-ND; Manufacturer Part Number: RC0402JR-071ML
R3 R8-R16 R19 R21-R27 R30-R32 R34 R35 R37 R38 R40-R43 R49-R53 R58 R60 = RES2
R20 R44 R47 R48 R54-R57 = Resistor: RES 10K OHM 1/10W 5% 0603 SMD; Part Number: RC0603JR-0710KL; Manufacturer: Yageo; Supplier 1: Digi-Key; Supplier Part Number 1: 311-10KGRCT-ND; Manufacturer Part Number: RC0603JR-0710KL
U1 = STM32F205RxTx
U2 = CE6200B33F
U4 = WS4538D
U5 = HSC32I1(DFB8)_S2V60
U6 = nRF52832-QFAA: Multi-protocol Bluetooth Low Energy and 2.4GHz proprietary system-on-chip; Manufacturer: Nordic Semiconductor; Artikkelnr Noca: N.A.; Part Number: nRF52832-QFAA; Manufacturer Part Number: nRF52832-QFAA; Datasheet: *; LatestRevisionDate: 2014-11-26; Pin Count: 48; Publisher: Nordic Semiconductor; Published: 2014-11-26; Value: nRF52832-QFAA; Note: *; Supplier: Nordic Semiconductor; Supplier part number: *; 2nd source Supplier: *; 2nd source part number: *; Footprint Doc: QFN-48; Artikkelnr Simpro: N.A.
U7 = R1200
X1 X2 = XTAL_4-pin_grounded: XTAL SMD 2520, 16MHz, 8pF, ?5ppm; Part Number: NX2520SA-16MHZ-STD-CSW-5; Manufacturer: NDK; Note: XTAL SMD 16.000MHz; Artikkelnr Noca: 22019192; Artikkelnr Simpro: N.A.; Manufacturer Part Number: NX2520SA-16MHZ-STD-CSW-5; Datasheet: http://www.ndk.com/images/products/catalog/c_NX2520SA-STD-CSW-5_e.pdf; LatestRevisionDate: 2012-06-15; Pin Count: 4; Publisher: Nordic Semiconductor; Published: 2012-06-15; Value: 16MHz; Supplier: Digi-Key; Supplier part number: 644-1169-1-ND; 2nd source Supplier: *; 2nd source part number: *; Footprint Doc: BT-XTAL_2520
Y1 = OSC_6
Z693_H93-A_KD01_V1.3 Z693_H93-B_KD01_V1.3 = LOGO